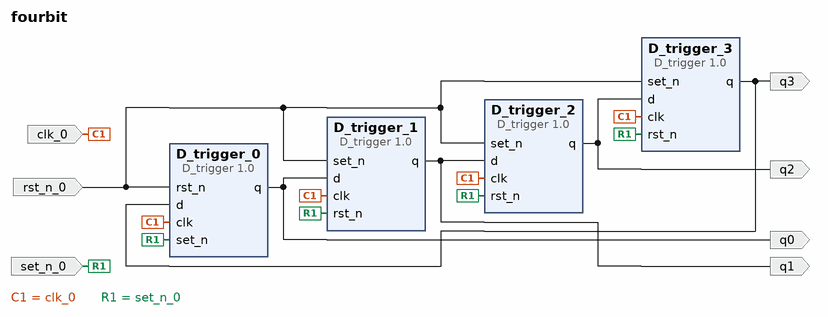
[diagram p0: block diagram of the top level]
# Vivado block design fourbit, xc7a35tcsg324-3, Vivado 2020.1
create_bd_design fourbit

create_bd_port -dir I -type clk clk_0
create_bd_port -dir I -type rst rst_n_0
create_bd_port -dir I set_n_0
create_bd_port -dir O q3
create_bd_port -dir O q2
create_bd_port -dir O q1
create_bd_port -dir O q0

create_bd_cell -type ip -vlnv xilinx.com:user:D_trigger:1.0 D_trigger_0
create_bd_cell -type ip -vlnv xilinx.com:user:D_trigger:1.0 D_trigger_1
create_bd_cell -type ip -vlnv xilinx.com:user:D_trigger:1.0 D_trigger_2
create_bd_cell -type ip -vlnv xilinx.com:user:D_trigger:1.0 D_trigger_3

# ---- connections ----

connect_bd_net -net clk_0_1 [get_bd_ports clk_0] \
  [get_bd_pins D_trigger_0/clk] [get_bd_pins D_trigger_1/clk] [get_bd_pins D_trigger_2/clk] [get_bd_pins D_trigger_3/clk]
connect_bd_net [get_bd_pins D_trigger_1/q] [get_bd_pins D_trigger_2/d] [get_bd_ports q1]
connect_bd_net [get_bd_pins D_trigger_2/q] [get_bd_pins D_trigger_3/d] [get_bd_ports q2]
connect_bd_net -net rst_n_0_1 [get_bd_ports rst_n_0] \
  [get_bd_pins D_trigger_0/rst_n] [get_bd_pins D_trigger_1/set_n] [get_bd_pins D_trigger_2/set_n] \
  [get_bd_pins D_trigger_3/set_n]
connect_bd_net -net set_n_0_1 [get_bd_ports set_n_0] \
  [get_bd_pins D_trigger_0/set_n] [get_bd_pins D_trigger_1/rst_n] [get_bd_pins D_trigger_2/rst_n] \
  [get_bd_pins D_trigger_3/rst_n]
connect_bd_net [get_bd_pins D_trigger_3/q] [get_bd_pins D_trigger_0/d] [get_bd_ports q3]
connect_bd_net [get_bd_pins D_trigger_0/q] [get_bd_pins D_trigger_1/d] [get_bd_ports q0]

validate_bd_design
save_bd_design
